# EasyEDA Pro project PCB1.epro

# Board PCB1
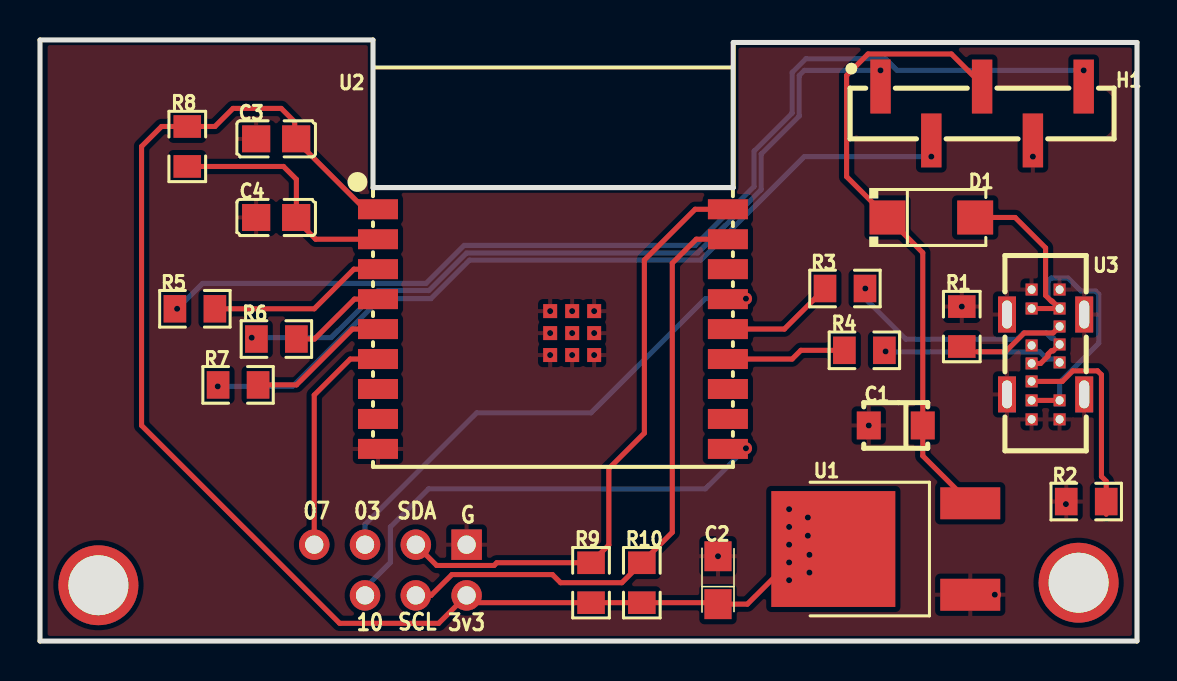
[diagram p0: board, top side]
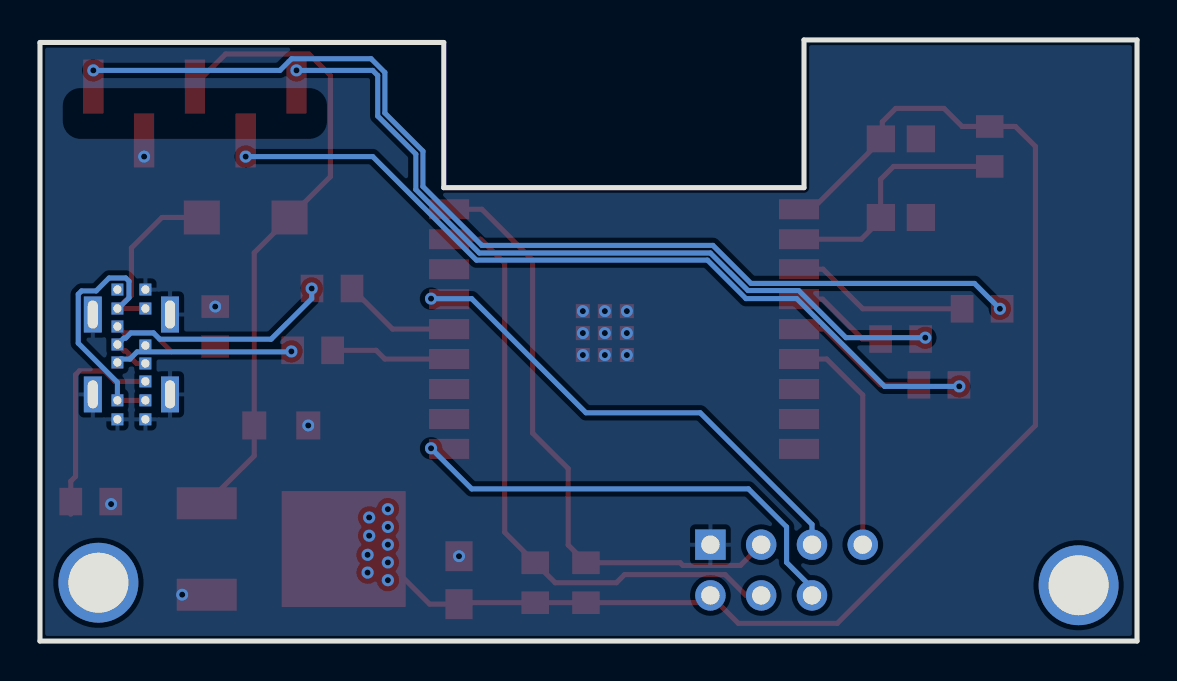
[diagram p1: board, bottom side, seen from below]

Outline 54.86 x 30.1 mm; copper layers: Top Layer, Bottom Layer. Coordinates in mm from the lower left corner of the outline.
Outline path: 0,30.1 16.65,30.1 16.65,22.7 34.67,22.7 34.67,29.97 54.86,29.97 54.86,0 0,0 0,30.1
Stack: Top Layer 0.035mm / Dielectric1 1.51mm FR4 er 4.5 / Bottom Layer 0.035mm

## Design rules (mm)
spacing copperThickness1oz (default): track to track 0.102, other pairs 0.152 to 0.3
spacing copperThickness2oz: track to track 0.203, other pairs 0.152 to 0.3
track width copperThickness1oz (default): min 0.127, default 0.254, max 2.54
track width copperThickness2oz: min 0.203, default 0.254, max 2.54
differential pair differentialPair (default): width min 0.127, default 0.254, max 2.54; gap min 0.152, default 0.152

## Placement (name value [footprint] x y rotation side)
C1  330nF  [CAP-SMD_L3.2-W1.6]  42.8 10.8 180 top
C2  10uF  [CASE-A_3216]  33.91 3.05 90 top
C3  100nF  [C0805]  11.81 25.15 0 top
C4  100nF  [C0805]  11.81 21.21 180 top
D1  1N5819  [SMA_L4.4-W2.6-LS5.0-RD]  44.58 21.21 0 top
H1  BG125-05-A-1-1-0440-N-D  [HDR-SMD_5P-P2.54-V-F-LS4.4]  47.12 26.42 180 top
NOREF  -  [Pad_e211]  16.26 2.29 0 top
NOREF#2  -  [Pad_e209]  21.34 4.83 0 top
NOREF#3  -  [Pad_e210]  13.72 4.83 0 top
NOREF#4  -  [Pad_e206]  21.34 2.29 0 top
NOREF#5  -  [Pad_e207]  18.8 4.83 0 top
NOREF#6  -  [Pad_e6]  51.94 2.92 0 top
NOREF#7  -  [Pad_e163]  2.92 2.79 0 top
NOREF#8  -  [Pad_e212]  16.26 4.83 0 top
NOREF#9  -  [Pad_e208]  18.8 2.29 0 top
R1  5.1kΩ  [R0805]  46.1 15.75 90 top
R2  5.1kΩ  [R0805]  52.32 6.98 0 top
R3  33Ω  [R0805]  40.26 17.65 180 top
R4  33Ω  [R0805]  41.23 14.56 180 top
R5  220Ω  [R0805]  7.75 16.64 0 top
R6  220Ω  [R0805]  11.82 15.12 0 top
R7  220Ω  [R0805]  9.91 12.83 0 top
R8  10kΩ  [R0805]  7.37 24.77 90 top
R9  10kΩ  [R0805]  27.56 2.92 90 top
R10  10kΩ  [R0805]  30.1 2.92 270 top
U1  MC33269DT-3.3G  [TO-252-2_L6.6-W6.1-P4.57-LS9.9-BR-CW]  43.1 4.61 0 top
U2  2.4GHz  [BULETM-SMD_ESPRESSIF_ESP32-C3-WROOM-02-N4-4MB]  25.65 15.62 0 top
U3  TYPEC-214-ARP14H105  [USB-TYPE-C-TH_TYPEC-214-ARP14H105]  50.29 14.35 90 top

## Footprints (pads in the part's own frame, mm; a bottom-side part is the same pattern mirrored in y, then rotated)
BULETM-SMD_ESPRESSIF_ESP32-C3-WROOM-02-N4-4MB
  rect 2x1 smd: 1(-8.75,6) 2(-8.75,4.5) 3(-8.75,3) 4(-8.75,1.5) 5(-8.75,0) 6(-8.75,-1.5) 7(-8.75,-3) 8(-8.75,-4.5) 9(-8.75,-6) 10(8.75,-6) 11(8.75,-4.5) 12(8.75,-3) 13(8.75,-1.5) 14(8.75,0) 15(8.75,1.5) 16(8.75,3) 17(8.75,4.5) 18(8.75,6)
  rect 0.7x0.7 smd: 19(-0.14,0.9) 19(-0.14,-0.2) 19(-0.14,-1.3) 19(0.96,0.9) 19(0.96,-0.2) 19(0.96,-1.3) 19(2.06,0.9) 19(2.06,-0.2) 19(2.06,-1.3)
C0805
  rect 1.41x1.35 smd: 1(-1,0) 2(1,0)
CAP-SMD_L3.2-W1.6
  rect 1.2x1.4 smd: 1(-1.35,0) 2(1.35,0)
CASE-A_3216
  rect 1.5x1.359 smd: 1(-1.2,0) 2(1.2,0)
HDR-SMD_5P-P2.54-V-F-LS4.4
  rect 1.02x2.7 smd: 1(5.08,-1.35) 2(2.54,1.35) 3(0,-1.35) 4(-2.54,1.35) 5(-5.08,-1.35)
Pad_e6
  round 4 hole 3: 1(0,0)
Pad_e163
  round 4 hole 3: 1(0,0)
Pad_e206
  round 1.524 hole 0.914: 1(0,0)
Pad_e207
  round 1.524 hole 0.914: 3(0,0)
Pad_e208
  round 1.524 hole 0.914: 2(0,0)
Pad_e209
  rect 1.524x1.524 hole 0.914: 3(0,0)
Pad_e210
  round 1.524 hole 0.914: 1(0,0)
Pad_e211
  round 1.524 hole 0.914: 2(0,0)
Pad_e212
  round 1.524 hole 0.914: 4(0,0)
R0805
  rect 1.133x1.377 smd: 1(-1,0) 2(1,0)
SMA_L4.4-W2.6-LS5.0-RD
  rect 1.8x1.7 smd: 1(-2.192,0) 2(2.192,0)
TO-252-2_L6.6-W6.1-P4.57-LS9.9-BR-CW
  rect 3x1.6 smd: 1(3.424,-2.29) 3(3.424,2.29)
  rect 6.2x5.8 smd: 2(-3.424,0)
USB-TYPE-C-TH_TYPEC-214-ARP14H105
  rect 1.8x0.9 hole 1.4x0.5: 0(-2,1.93) 0(-2,-1.93) 0(2,1.93) 0(2,-1.93)
  rect 0.6x0.6 hole 0.42x0.4: A1(-3.25,0.7) A4(-2.3,0.7) A5(-1.35,0.7) A6(-0.45,0.7) A7(0.45,0.7) A9(2.3,0.7) A12(3.25,0.7) B1(3.25,-0.7) B4(2.3,-0.7) B5(1.4,-0.7) B6(0.5,-0.7) B7(-0.4,-0.7) B9(-2.3,-0.7) B12(-3.25,-0.7)

## Nets
GND: C1.2 C2.2 C3.1 C4.2 H1.4 NOREF#2.3 R1.2 R2.1 U1.1 U2.9 U2.19 U3.0 U3.A1 U3.A12 U3.B1 U3.B12
VBAT: C1.1 D1.1 H1.3 U1.3
VBUS: D1.2 U3.A4 U3.A9 U3.B4 U3.B9
VCC: C2.1 C3.2 NOREF#4.1 R8.2 R9.1 R10.2 U1.2 U2.1
DATA: H1.5 R5.1
HB: H1.2 R7.1
IO3: NOREF#8.4 U2.15
IO7: NOREF#3.1 U2.6
IO10: NOREF.2 U2.10
RXD: U2.11
SCL: NOREF#9.2 R10.1 U2.17
SDA: NOREF#5.3 R9.2 U2.18
SIGNAL: H1.1 R6.1
TXD: U2.12
USB-D+: R3.1 U3.A6 U3.B6
USB-D-: R4.1 U3.A7 U3.B7
$1N29: R2.2 U3.A5
$1N37: R1.1 U3.B5
$1N69: R3.2 U2.14
$1N70: R4.2 U2.13
$1N77: R5.2 U2.3
$1N78: R6.2 U2.4
$1N81: R7.2 U2.5
$1N100: C4.1 R8.1 U2.2

Pads without a net: NOREF#6 1; NOREF#7 1; U2 7 8 16

## Via types
v1: diameter 0.61, hole 0.305, Top Layer to Bottom Layer, 34 vias

## Routing (per net, layer and track width the routed paths; a pad name or vN(x,y) marks a point on that pad's centre or on a via; arc(x,y) is an arc through that point)
GND:
  vias: v1(25.51,16.52) v1(25.51,15.42) v1(25.51,14.32) v1(26.61,16.52) v1(26.61,15.42) v1(26.61,14.32) v1(27.71,16.52) v1(27.71,15.42) v1(27.71,14.32) v1(33.91,4.25) v1(41.45,10.8) v1(46.1,16.75) v1(47.75,2.32) v1(49.66,24.26) v1(51.31,6.86)
VBAT: length 31.8
  Top Layer w0.254: U1.3 44.15,9.27 C1.1 44.15,19.44 D1.1 40.34,23.25 40.34,28.32 41.41,29.4 45.58,29.4 47.12,27.86
VBUS: length 21
  Top Layer w0.254: U3.A9 U3.B4 50.62,17.02 50.58,17.02 50.29,17.31 50.29,19.69 48.77,21.21 D1.2 ; U3.A4 U3.B9
  Bottom Layer w0.254: U3.B4 50.95,16.65 50.41,17.19 50.41,18.02 50.58,18.18 51.41,18.18 52.06,17.53 52.79,17.53 52.95,17.37 52.95,14.92 50.99,12.96 U3.B9
VCC: length 69.8
  Top Layer w0.254: U2.1 16.25,21.62 12.74,25.14 12.74,26 12.06,26.67 9.65,26.67 8.75,25.77 R8.2 6.08,25.77 5.08,24.77 5.08,10.8 14.99,0.89 19.94,0.89 NOREF#4.1 21.7,1.92 R9.1 R10.2 33.84,1.92 C2.1 35.38,1.85 v1(37.47,3.94) 38.14,4.61 U1.2
  vias: v1(37.47,6.6) v1(37.47,5.72) v1(37.47,4.83) v1(37.47,3.05) v1(38.4,6.19) v1(38.4,5.28) v1(38.48,4.32) v1(38.48,3.43)
DATA: length 53
  Bottom Layer w0.254: v1(52.2,28.58) 42.86,28.58 42.28,29.16 38.31,29.16 37.62,28.47 37.62,26.44 35.71,24.53 35.71,22.76 32.77,19.81 21.21,19.81 19.3,17.91 8.13,17.91 v1(6.86,16.64)
HB: length 40.5
  Bottom Layer w0.254: v1(8.89,12.75) 12.62,12.75 17.02,17.15 19.55,17.15 21.48,19.08 33.04,19.08 38.22,24.26 v1(44.58,24.26)
IO3: length 24.7
  Bottom Layer w0.254: v1(35.31,17.15) 33.27,17.15 27.56,11.43 21.84,11.43 16.26,5.84 NOREF#8.4
IO7: length 11.4
  Top Layer w0.254: NOREF#3.1 13.72,12.32 15.52,14.12 U2.6
IO10: length 23.4
  Bottom Layer w0.254: v1(35.31,9.65) 33.27,7.62 19.43,7.62 17.53,5.72 17.53,3.94 16.26,2.67 NOREF.2
SCL: length 31.2
  Top Layer w0.254: NOREF#9.2 19.56,2.29 20.6,3.33 25.63,3.33 26.03,2.92 29.1,2.92 R10.1 31.62,5.45 31.62,18.92 32.82,20.12 U2.17
SDA: length 30.7
  Top Layer w0.254: NOREF#5.3 19.84,3.79 22.71,3.79 22.84,3.92 R9.2 28.45,4.81 28.45,8.64 30.23,10.41 30.23,19.08 32.77,21.62 U2.18
SIGNAL: length 39.2
  Bottom Layer w0.254: v1(10.59,15.19) 14.56,15.19 16.92,17.55 19.46,17.55 21.34,19.43 32.89,19.43 36.07,22.61 36.07,24.38 37.97,26.29 37.97,28.32 38.23,28.58 v1(42.04,28.58)
USB-D+: length 13.3
  Top Layer w0.254: U3.A6 50.04,13.9 50.41,14.27 50.41,14.37 50.58,14.53 50.67,14.53 U3.B6
  Bottom Layer w0.254: v1(41.28,17.65) 41.28,17.15 43.31,15.11 48.87,15.11 49.19,15.43 50.32,15.43 50.58,15.17 50.67,15.17 U3.B6
USB-D-: length 8.9
  Bottom Layer w0.254: v1(42.29,14.5) 42.31,14.48 50.01,14.48 50.37,14.12 50.82,14.12 U3.B7
$1N29: length 10.9
  Top Layer w0.254: U3.A5 51.13,13 51.66,13.53 52.89,13.53 53.09,13.34 53.09,8.24 53.32,8 53.32,6.35
$1N37: length 4.7
  Top Layer w0.254: 46.86,14.49 48.28,14.49 49.23,15.43 50.67,15.43 U3.B5
$1N69: length 5.7
  Top Layer w0.254: R3.2 37.23,15.62 U2.14
$1N70: length 6
  Top Layer w0.254: U2.13 37.62,14.12 38.05,14.56 R4.2
$1N77: length 9
  Top Layer w0.254: R5.2 13.72,16.64 15.7,18.62 U2.3
$1N78: length 4.9
  Top Layer w0.254: U2.4 15.72,17.12 13.73,15.12 R6.2
$1N81: length 7.2
  Top Layer w0.254: R7.2 12.83,12.83 15.62,15.62 U2.5
$1N100: length 12.2
  Top Layer w0.254: R8.1 12.18,23.77 12.82,23.12 12.82,21.83 13.21,21.44 13.21,20.7 13.79,20.12 U2.2

## Copper pours and planes (outline as drawn; the poured copper is in the pictures)
GND on Top Layer: 0.38,29.97 55.25,29.97 55.25,0.13 0.38,0.13
GND on Bottom Layer: 0,30.1 54.86,30.1 54.86,0.25 0,0.25

## Text on the board
Top Silkscreen Layer: 07 | 03 | 10 | SDA | SCL | 3v3 | G
